# Altium project Tigershark 3D.PrjPcb
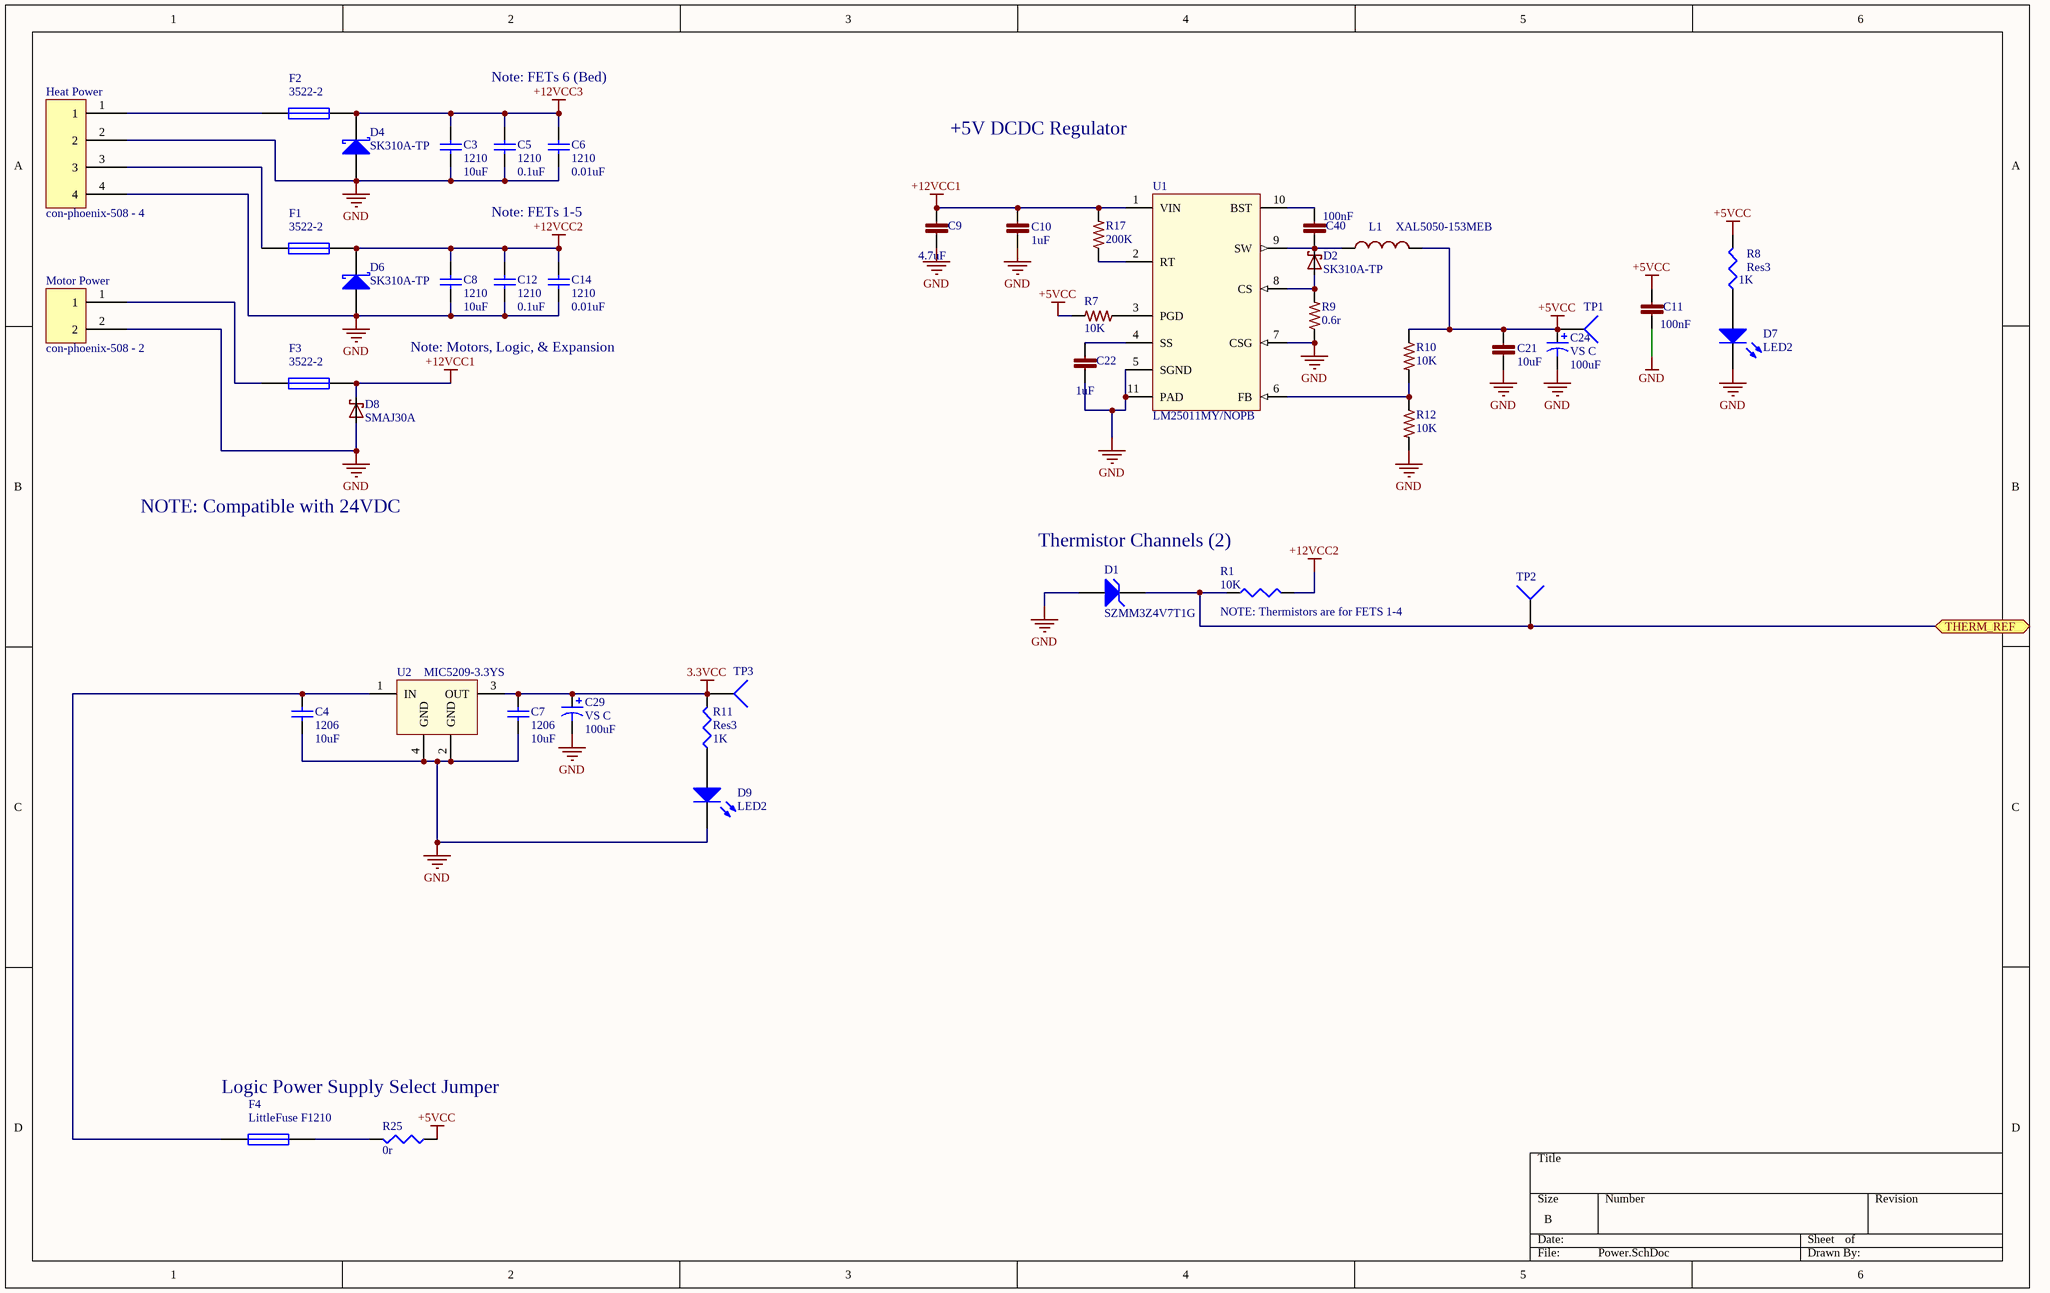
[diagram p0: Power.SchDoc]
4 sheets, 77 parts. Net scope: flat (ports and power ports of the same name join across sheets).
Board file: Tigershark 3D R1.8.PcbDoc
Sheets:
  Power.SchDoc
  ES.SchDoc
  M.SchDoc
  TR.SchDoc

## Sheet Power.SchDoc
size B

### Parts
C3  1210  value 10uF  [C1210]
C4  1206  value 10uF  [C1206]
C5  1210  value 0.1uF  [C1210]
C6  1210  value 0.01uF  [C1210]
C7  1206  value 10uF  [C1206]
C8  1210  value 10uF  [C1210]
C9  4.7uF  [C1206]
C10  1uF  [C0805]
C11  100nF  [C0603]
C12  1210  value 0.1uF  [C1210]
C14  1210  value 0.01uF  [C1210]
C21  10uF  [C0805]
C22  1uF  [C0402]
C24  VS C  value 100uF  [Panasonic VS C]
C29  VS C  value 100uF  [Panasonic VS C]
C40  100nF  [C0603]
D1  SZMM3Z4V7T1G  [SZMM3Z4V7T1G]
D2  SK310A-TP  [SMA-SM]
D4  SK310A-TP  [SK310A-TP]
D6  SK310A-TP  [SK310A-TP]
D7  LED2  [SM 0805 polarized]
D8  SMAJ30A  [SMA-SM]
D9  LED2  [SM 0805 polarized]
F1  3522-2  [3522-2 - WAVE SOLDER]
F2  3522-2  [3522-2 - WAVE SOLDER]
F3  3522-2  [3522-2 - WAVE SOLDER]
F4  LittleFuse F1210  [F1210_M]
Heat_Power  con-phoenix-508 - 4  [MSTBV4]
L1  XAL5050-153MEB  [XAL50xx-153]
Motor_Power  con-phoenix-508 - 2  [MSTBV2 - duplicate]
R1  value 10K  [J1-0603]  (hidden comment: Res3)
R7  10K  [R0603]
R8  Res3  value 1K  [SM 0805 - gap trimmed]
R9  0.6r  [2512R-0.55]
R10  10K  [R0603]
R11  Res3  value 1K  [SM 0805 - gap trimmed]
R12  10K  [R0603]
R17  200K  [R0402]
R25  value 0r  [SM 0805 - gap trimmed]  (hidden comment: Res3)
TP1  TP4  [TP-2]  (value not drawn)
TP2  TP4  [TP-2]  (value not drawn)
TP3  TP4  [TP-2]  (value not drawn)
U1  LM25011MY/NOPB  [VSSOP10]
U2  MIC5209-3.3YS  [SOT230P700X190-4N]

### Ports
THERM_REF

### Nets
3.3VCC: C7.2 C29.1 R11.2 TP3.1 U2.3(OUT)
+5VCC: C11.1 C21.1 C24.1 L1.2 R7.2 R8.2 R10.1 R25.1 TP1.1
+12VCC1: C9.1 C10.1 D8.C F3.2 R17.2 U1.1(VIN)
+12VCC2: C8.2 C12.2 C14.2 D6.2(K) F1.2 R1.2
+12VCC3: C3.2 C5.2 C6.2 D4.2(K) F2.2
GND: C3.1 C4.1 C5.1 C6.1 C7.1 C8.1 C9.2 C10.2 C11.2 C12.1 C14.1 C21.2 C22.2 C24.2 C29.2 D1.1(A) D4.1(A) D6.1(A) D7.1(A) D8.A D9.1(A) Heat_Power.2 Heat_Power.4 Motor_Power.2 R9.1 R12.2 U1.5(SGND) U1.7(CSG) U1.11(PAD) U2.2(GND) U2.4(GND)
NetC4_2: C4.2 F4.1 U2.1(IN)
NetC22_1: C22.1 U1.4(SS)
NetC40_1: C40.1 U1.10(BST)
NetC40_2: C40.2 D2.C L1.1 U1.9(SW)
NetD1_2: D1.2(K) R1.1 TP2.1 ; port THERM_REF
NetD2_A: D2.A R9.2 U1.8(CS)
NetD7_2: D7.2(K) R8.1
NetD9_2: D9.2(K) R11.1
NetF1_1: F1.1 Heat_Power.3
NetF2_1: F2.1 Heat_Power.1
NetF3_1: F3.1 Motor_Power.1
NetF4_2: F4.2 R25.2
NetR7_1: R7.1 U1.3(PGD)
NetR10_2: R10.2 R12.1 U1.6(FB)
NetR17_1: R17.1 U1.2(RT)

### Notes on the sheet
- Note: FETs 6 (Bed)
- +5V DCDC Regulator
- Note: FETs 1-5
- Note: Motors, Logic, & Expansion
- NOTE: Compatible with 24VDC
- Thermistor Channels (2)
- (near R1) NOTE: Thermistors are for FETS 1-4
- Logic Power Supply Select Jumper

### Library data of the parts
C3-C8 C12 C14 = Cap Semi: Capacitor (Semiconductor SIM Model); Published: 8-Jun-2000; LatestRevisionDate: 29-May-2009; LatestRevisionNote: IPC-7351 Footprint Added.; PackageReference: C1206; Publisher: Altium Limited; PackageDescription: Chip Capacitor
C9 = C1206C475K5PACTU: CAP CER 1206 4.7uF 50V 10% X5R; LastRevisionNote: ImportComponents; Published: 23-Apr-2014; Publisher: UltiMachine; LastRevisionDate: 23-Apr-2014; ManufacturerPartNumber: C1206C475K5PACTU; VALUE: 4.7uF
C10 = GRM21BR71H105KA12L: CAP CER 0805 1uF 50V 10% X7R; LastRevisionNote: ImportComponents; Published: 23-Apr-2014; Publisher: UltiMachine; LastRevisionDate: 23-Apr-2014; ManufacturerPartNumber: GRM21BR71H105KA12L; VALUE: 1uF
C11 C40 = C0603C104K5RACTU: CAP CER 0603 100nF 50V 10% X7R; LastRevisionNote: ImportComponents; LastRevisionDate: 23-Apr-2014; ManufacturerPartNumber: C0603C104K5RACTU; Published: 23-Apr-2014; Publisher: UltiMachine; VALUE: 100nF
C21 = C0805C106K8PACTU: CAP CER 0805 10uF 10V 10% X5R; LastRevisionNote: ImportComponents; Published: 23-Apr-2014; Publisher: UltiMachine; LastRevisionDate: 23-Apr-2014; ManufacturerPartNumber: C0805C106K8PACTU; VALUE: 10uF
C22 = GRM155R60J105KE19D: CAP CER 0402 1uF 6.3V 10% X5R; LastRevisionNote: ImportComponents; Published: 23-Apr-2014; Publisher: UltiMachine; LastRevisionDate: 23-Apr-2014; ManufacturerPartNumber: GRM155R60J105KE19D; VALUE: 1uF
C24 C29 = Cap Pol3: Polarized Capacitor (Surface Mount); Published: 8-Jun-2000; LatestRevisionDate: 29-May-2009; LatestRevisionNote: IPC-7351 Footprint Added.; PackageReference: C0805; Publisher: Altium Limited; PackageDescription: Chip Capacitor
D1 = D Zener: Zener Diode; Published: 8-Jun-2000; LatestRevisionDate: 17-Jul-2002; LatestRevisionNote: Re-released for DXP Platform.; PackageReference: DIODE-0.7; Publisher: Altium Limited; PackageDescription: Diode, Thru-Hole; 2 Leads; 0.7 in Pin Spacing
D2 = SK310A: DIODE Schottky 3A SMA; LastRevisionNote: ImportComponents; LastRevisionDate: 23-Apr-2014; ManufacturerPartNumber: SK310A; Published: 23-Apr-2014; Publisher: UltiMachine
D4 D6 = D Schottky: Schottky Diode; Published: 8-Jun-2000; LatestRevisionDate: 17-Jul-2002; LatestRevisionNote: Re-released for DXP Platform.; PackageReference: SMB; Publisher: Altium Limited; PackageDescription: DO-214-AA/SMB; 2 C-Bend Leads; Body 5.3 x 3.6 mm, inc. leads (LxW); Code_JEDEC: DO-214-AA
D7 D9 = LED2: Typical RED, GREEN, YELLOW, AMBER GaAs LED; Published: 8-Jun-2000; LatestRevisionDate: 17-Jul-2002; LatestRevisionNote: Re-released for DXP Platform.; PackageVersion: Feb-2002; PackageReference: 3.2X1.6X1.1; Publisher: Altium Limited; PackageDescription: SM LED; 2 Flat Leads
D8 = SMAJ30A: DIODE TVS 30V SMA; LastRevisionNote: ImportComponents; Published: 23-Apr-2014; Publisher: UltiMachine; LastRevisionDate: 23-Apr-2014; ManufacturerPartNumber: SMAJ30A
F1-F4 = Fuse 1: Fuse; Published: 8-Jun-2000; LatestRevisionDate: 17-Jul-2002; LatestRevisionNote: Re-released for DXP Platform.; PackageReference: PIN-W2/E2.8; Publisher: Altium Limited; PackageDescription: Thru-Hole; 2 Leads
Heat_Power = con-phoenix-508_4
L1 = XAL5050-153MEB: IND 15uH 3.9A 20%; LastRevisionNote: ImportComponents; Published: 23-Apr-2014; Publisher: UltiMachine; LastRevisionDate: 23-Apr-2014; ManufacturerPartNumber: XAL5050-153MEB; Value: XAL5050-153MEB
Motor_Power = con-phoenix-508_2
R1 R8 R11 R25 = Res3: Resistor; Published: 8-Jun-2000; LatestRevisionDate: 29-May-2009; LatestRevisionNote: IPC-7351 Footprint Added.; PackageReference: J1-0603; Publisher: Altium Limited; PackageDescription: Chip Resistor
R7 R10 R12 = ERJ-3EKF1002V: RES 0603 10K 100mW 1%; LastRevisionNote: ImportComponents; Published: 23-Apr-2014; Publisher: UltiMachine; LastRevisionDate: 23-Apr-2014; ManufacturerPartNumber: ERJ-3EKF1002V; VALUE: 10K
R9 = RL2512FK-070R06L: RES 0.06 OHM 1W 1% 2512 SMD; LastRevisionNote: ImportComponents; Published: 23-Apr-2014; Publisher: UltiMachine; LastRevisionDate: 23-Apr-2014; ManufacturerPartNumber: RL2512FK-070R06L; VALUE: 0.6r
R17 = CRCW0402200KFKED: RES 0402 22r 63mW 1%; LastRevisionNote: ImportComponents; Published: 23-Apr-2014; Publisher: UltiMachine; LastRevisionDate: 23-Apr-2014; ManufacturerPartNumber: CRCW0402200KFKED; VALUE: 200K
TP1-TP3 = Socket: LatestRevisionDate: 17-Jul-2002; LatestRevisionNote: Re-released for DXP Platform.; Publisher: Altium Limited
U1 = LM25011: REG BUCK; Value: LM25011MY/NOPB

## Sheet ES.SchDoc
size A
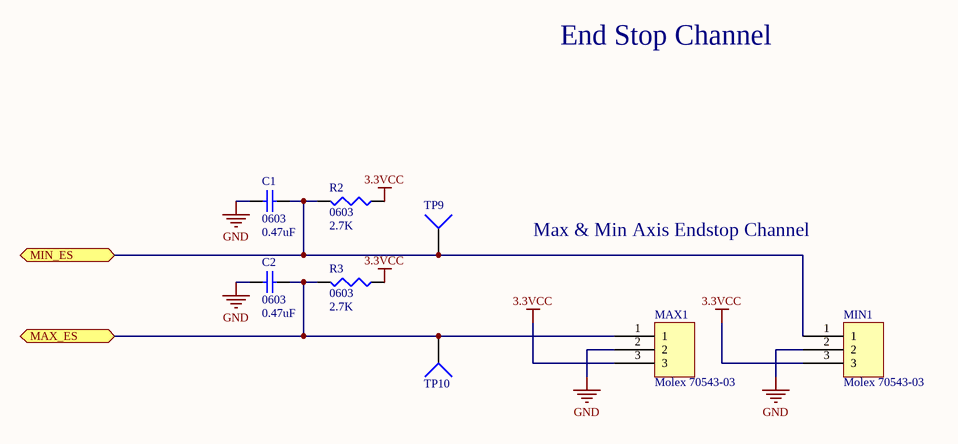
[diagram p1: ES.SchDoc]

### Parts
C1  0603  value 0.47uF  [1608[0603]]
C2  0603  value 0.47uF  [1608[0603]]
MAX1  Molex 70543-03  [70543-03]
MIN1  Molex 70543-03  [70543-03]
R2  0603  value 2.7K  [J1-0603]
R3  0603  value 2.7K  [J1-0603]
TP9  TP4  [TP-2]  (value not drawn)
TP10  TP4  [TP-2]  (value not drawn)

### Ports
MAX_ES, MIN_ES

### Nets
3.3VCC: MAX1.3 MIN1.3 R2.1 R3.1
GND: C1.2 C2.2 MAX1.2 MIN1.2
NetC1_1: C1.1 MIN1.1 R2.2 TP9.1 ; port MIN_ES
NetC2_1: C2.1 MAX1.1 R3.2 TP10.1 ; port MAX_ES

### Notes on the sheet
- End Stop Channel
- Max & Min Axis Endstop Channel

### Library data of the parts
C1 C2 = Cap Semi: Capacitor (Semiconductor SIM Model); Published: 8-Jun-2000; LatestRevisionDate: 29-May-2009; LatestRevisionNote: IPC-7351 Footprint Added.; PackageReference: C1206; Publisher: Altium Limited; PackageDescription: Chip Capacitor
MAX1 MIN1 = Molex Endstop
R2 R3 = Res3: Resistor; Published: 8-Jun-2000; LatestRevisionDate: 29-May-2009; LatestRevisionNote: IPC-7351 Footprint Added.; PackageReference: J1-0603; Publisher: Altium Limited; PackageDescription: Chip Resistor
TP9 TP10 = Socket: LatestRevisionDate: 17-Jul-2002; LatestRevisionNote: Re-released for DXP Platform.; Publisher: Altium Limited

## Sheet M.SchDoc
size A
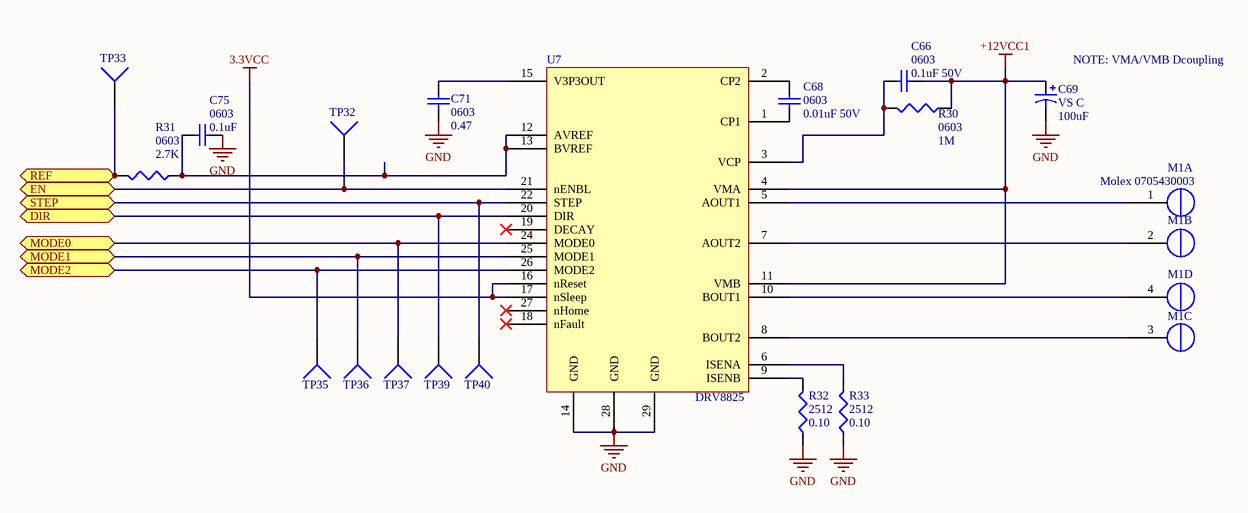
[diagram p2: M.SchDoc]

### Parts
C66  0603  value 0.1uF 50V  [1608[0603]]
C68  0603  value 0.01uF 50V  [1608[0603]]
C69  VS C  value 100uF  [Panasonic VS C]
C71  0603  value 0.47  [1608[0603]]
C75  0603  value 0.1uF  [1608[0603]]
M1  Molex 0705430003  [4POL254]  (parts A,B,C,D of 4)
R30  0603  value 1M  [J1-0603]
R31  0603  value 2.7K  [J1-0603]
R32  2512  value 0.10  [Resistor2512]
R33  2512  value 0.10  [Resistor2512]
TP32  TP4  [TP-2]  (value not drawn)
TP33  TP4  [TP-2]  (value not drawn)
TP35  TP4  [TP-2]  (value not drawn)
TP36  TP4  [TP-2]  (value not drawn)
TP37  TP4  [TP-2]  (value not drawn)
TP39  TP4  [TP-2]  (value not drawn)
TP40  TP4  [TP-2]  (value not drawn)
U7  DRV8825  [DRV8825]

### Ports
DIR, EN, MODE0, MODE1, MODE2, REF, STEP

### Nets
3.3VCC: U7.16(nReset) U7.17(nSleep)
+12VCC1: C66.1 C69.1 R30.1 U7.4(VMA) U7.11(VMB)
GND: C69.2 C71.1 C75.1 R32.1 R33.1 U7.14(GND) U7.28(GND) U7.29(GND)
NetC66_2: C66.2 R30.2 U7.3(VCP)
NetC68_1: C68.1 U7.1(CP1)
NetC68_2: C68.2 U7.2(CP2)
NetC71_2: C71.2 U7.15(V3P3OUT)
NetC75_2: C75.2 R31.1 U7.12(AVREF) U7.13(BVREF)
NetM1_1: M1.1(OUT2B) U7.5(AOUT1)
NetM1_2: M1.2(OUT2A) U7.7(AOUT2)
NetM1_3: M1.3(OUT1A) U7.8(BOUT2)
NetM1_4: M1.4(OUT1B) U7.10(BOUT1)
NetR31_2: R31.2 TP33.1 ; port REF
NetR32_2: R32.2 U7.9(ISENB)
NetR33_2: R33.2 U7.6(ISENA)
NetTP32_1: TP32.1 U7.21(nENBL) ; port EN
NetTP35_1: TP35.1 U7.26(MODE2) ; port MODE2
NetTP36_1: TP36.1 U7.25(MODE1) ; port MODE1
NetTP37_1: TP37.1 U7.24(MODE0) ; port MODE0
NetTP39_1: TP39.1 U7.20(DIR) ; port DIR
NetTP40_1: TP40.1 U7.22(STEP) ; port STEP

Not connected (* = marked no-connect by the designer): U7 18(nFault)* 19(DECAY)* 23(NC) 27(nHome)*

### Notes on the sheet
- (near C69) NOTE: VMA/VMB Dcoupling

### Library data of the parts
C66 C68 C71 C75 = Cap Semi: Capacitor (Semiconductor SIM Model); Published: 8-Jun-2000; LatestRevisionDate: 29-May-2009; LatestRevisionNote: IPC-7351 Footprint Added.; PackageReference: C1206; Publisher: Altium Limited; PackageDescription: Chip Capacitor
C69 = Cap Pol1: Polarized Capacitor (Radial); Published: 8-Jun-2000; LatestRevisionDate: 17-Jul-2002; LatestRevisionNote: Re-released for DXP Platform.; PackageReference: RB7.6-15; Publisher: Altium Limited; PackageDescription: Polarized Capacitor (Radial); 2 Leads
M1 = Molex 0705430003 Alt: Molex 4 Pin Clip Connector
R30-R33 = Res3: Resistor; Published: 8-Jun-2000; LatestRevisionDate: 29-May-2009; LatestRevisionNote: IPC-7351 Footprint Added.; PackageReference: J1-0603; Publisher: Altium Limited; PackageDescription: Chip Resistor
TP32 TP33 TP35-TP37 TP39 TP40 = Socket: LatestRevisionDate: 17-Jul-2002; LatestRevisionNote: Re-released for DXP Platform.; Publisher: Altium Limited
U7 = DRV8825: DRV8825 Ti Stepper Driver

## Sheet TR.SchDoc
size A
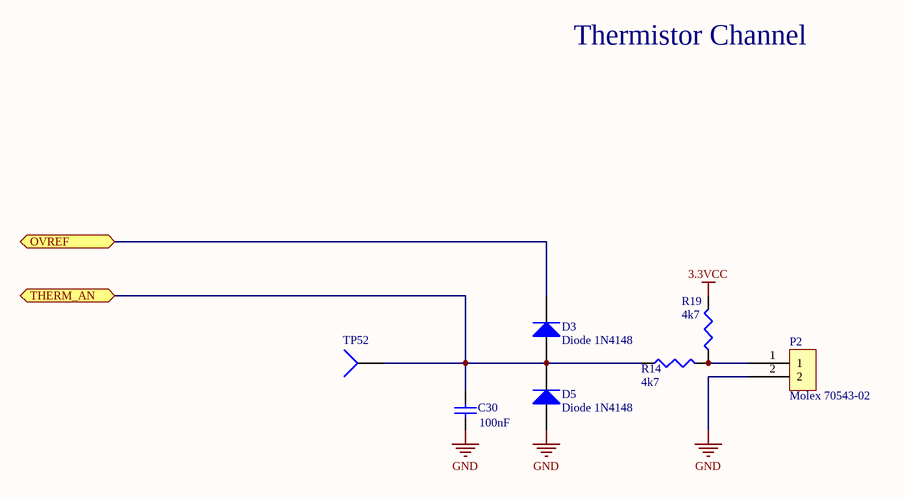
[diagram p3: TR.SchDoc]

### Parts
C30  value 100nF  [1608[0603]]  (hidden comment: Cap Semi)
D3  Diode 1N4148  [1N4148WT]
D5  Diode 1N4148  [1N4148WT]
P2  Molex 70543-02  [70543-02]
R14  value 4k7  [J1-0603]  (hidden comment: Res3)
R19  value 4k7  [J1-0603]  (hidden comment: Res3)
TP52  TP4  [TP-2]  (value not drawn)

### Ports
OVREF, THERM_AN

### Nets
3.3VCC: R19.2
GND: C30.1 D5.1(A) P2.2
NetC30_2: C30.2 D3.1(A) D5.2(K) R14.1 TP52.1 ; port THERM_AN
NetD3_2: D3.2(K) ; port OVREF
NetP2_1: P2.1 R14.2 R19.1

### Notes on the sheet
- Thermistor Channel

### Library data of the parts
C30 = Cap Semi: Capacitor (Semiconductor SIM Model); Published: 8-Jun-2000; LatestRevisionDate: 29-May-2009; LatestRevisionNote: IPC-7351 Footprint Added.; PackageReference: C1206; Publisher: Altium Limited; PackageDescription: Chip Capacitor
D3 D5 = Diode 1N4148: High Conductance Fast Diode; Published: 8-Jun-2000; LatestRevisionDate: 17-Jul-2002; LatestRevisionNote: Re-released for DXP Platform.; DatasheetVersion: 1997; PackageReference: DO-35; Publisher: Altium Limited; PackageDescription: Diode, Axial; Body 3.8 x 1.9 mm (LxDia. max), Lead Dia. 0.53 mm (max); Code_JEDEC: DO-204-AH; ComponentLink1Description: Manufacturer Link; ComponentLink1URL: http://www.fairchildsemi.com/; ComponentLink2Description: Datasheet; ComponentLink2URL: http://www.fairchildsemi.com/ds/1N%2F1N4148.pdf
R14 R19 = Res3: Resistor; Published: 8-Jun-2000; LatestRevisionDate: 29-May-2009; LatestRevisionNote: IPC-7351 Footprint Added.; PackageReference: J1-0603; Publisher: Altium Limited; PackageDescription: Chip Resistor
TP52 = Socket: LatestRevisionDate: 17-Jul-2002; LatestRevisionNote: Re-released for DXP Platform.; Publisher: Altium Limited

## Nets that join several sheets
3.3VCC: Power (5 pins), ES (MAX1.3 MIN1.3 R2.1 R3.1), M (U7.16 U7.17), TR (R19.2)
+12VCC1: Power (6 pins), M (5 pins)
GND: Power (31 pins), ES (C1.2 C2.2 MAX1.2 MIN1.2), M (8 pins), TR (C30.1 D5.1 P2.2)